# Altium schematic sheet Encoder.SchDoc
size A4; SheetNumber: 3; SheetTotal: 4
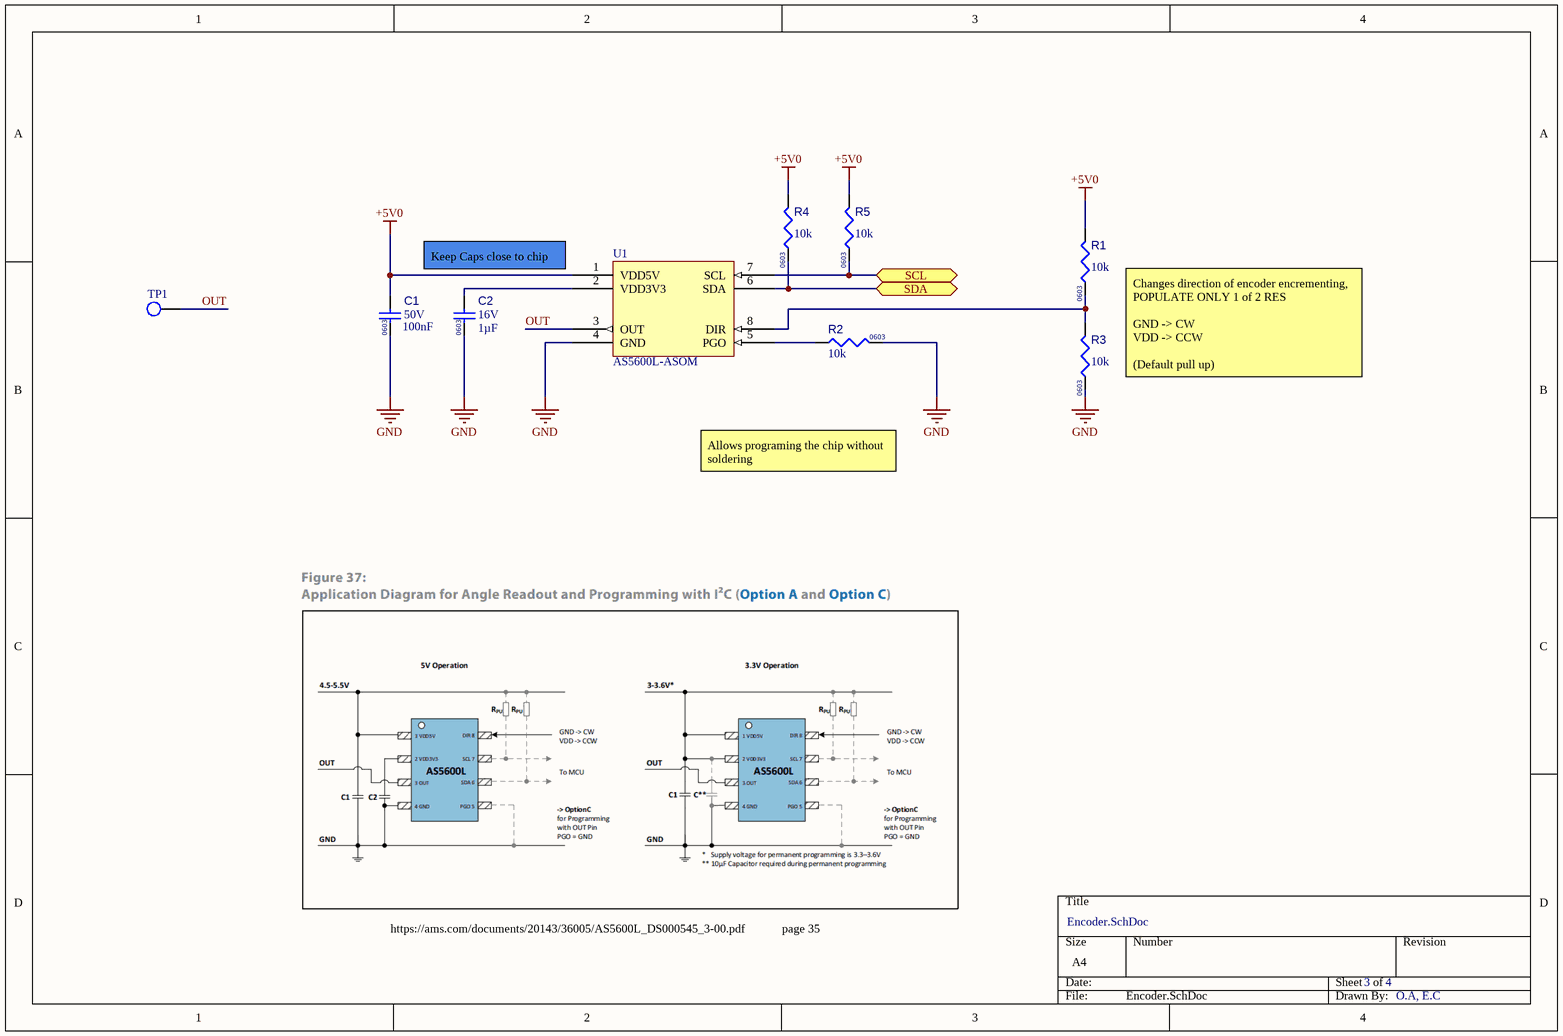
[diagram p0: Encoder.SchDoc]

## Parts
C1  value 100nF  Voltage Rating: 50V  Case/Package: 0603  [CAPC1608X90X40NL10T20]  (hidden comment: Capacitor 100 nF +/-10% 50 V 0603)
C2  value 1µF  Case/Package: 0603  Voltage Rating: 16V  [CAPC1608X90X35NL15T15]  (hidden comment: Capacitor 1uF +/- 10% 16V 0603)
R1  value 10k  Case/Package: 0603  [RESC1608X55X25NL10T15]  (hidden comment: Resistor 10k +/-1% 0603 100 mW)
R2  value 10k  Case/Package: 0603  [RESC1608X55X25NL10T15]  (hidden comment: Resistor 10k +/-1% 0603 100 mW)
R3  value 10k  Case/Package: 0603  [RESC1608X55X25NL10T15]  (hidden comment: Resistor 10k +/-1% 0603 100 mW)
R4  value 10k  Case/Package: 0603  [RESC1608X55X25NL10T15]  (hidden comment: Resistor 10k +/-1% 0603 100 mW)
R5  value 10k  Case/Package: 0603  [RESC1608X55X25NL10T15]  (hidden comment: Resistor 10k +/-1% 0603 100 mW)
TP1  RCUCTE  [FP-S2761-46R-MFG]  (value not drawn)
U1  AS5600L-ASOM  [AS5600L-ASOM-Footprint-1]

## Ports
SCL (bidir), SDA (bidir)

## Nets
+5V0: C1.2 R1.2 R4.2 R5.2 U1.1(VDD5V)
GND: C1.1 C2.1 R2.2 R3.1 U1.4(GND)
OUT: TP1.1 U1.3(OUT)
SCL: R5.1 U1.7(SCL) ; port SCL
SDA: R4.1 U1.6(SDA) ; port SDA
NetC2_2: C2.2 U1.2(VDD3V3)
NetR1_1: R1.1 R3.2 U1.8(DIR)
NetR2_1: R2.1 U1.5(PGO)

## Notes on the sheet
- Keep Caps close to chip
- Changes direction of encoder encrementing, POPULATE ONLY 1 of 2 RES
  GND -> CW
  VDD -> CCW
  (Default pull up)
- Allows programing the chip without soldering
- https://ams.com/documents/20143/36005/AS5600L_DS000545_3-00.pdf
- page 35
- O.A, E.C

## Library data of the parts
C1 = CMP-001-00017-8: Chip Capacitor, 100 nF, +/- 10%, 50 V, 0603 (1608 Metric); Capacitor Type: Ceramic; Tolerance: 10%; Mounting Technology: SM; Max Operating Temperature: 125°C; RoHS Compliant: True; Pins: 2; Min Operating Temperature: -55°C
C2 = CMP-001-00004-8: Chip Capacitor, 1 uF, +/- 10%, 16 V, 0603 (1608 Metric); Capacitor Type: Ceramic; Mounting Technology: SM; RoHS Compliant: True; Min Operating Temperature: -55°C; Pins: 2; Max Operating Temperature: 125°C; Tolerance: 10%
R1-R5 = CMP-009-00017-7: Chip Resistor, 10 KOhm, +/- 1%, 01 W, -55 to 155 degC, 0603 (1608 Metric); Voltage Rating: 50V; Power: 100mW; RoHS Compliant: True; Min Operating Temperature: -55°C; Pins: 2; Mounting Technology: SM; Max Operating Temperature: 155°C; Tolerance: 1%
TP1 = CMP-002-00072-5: Test point; Connector Type: Interconnection Device; Pins: 2; Max Operating Temperature: 125°C; Case/Package: 0603; Mounting Technology: Surface Mount; RoHS Compliant: Yes; Min Operating Temperature: -55°C
U1 = CMP-010-00024-5: AS5600L Series 12-Bit Programmable On-Axis Magnetic Rotary Position Sensor; Min Supply Voltage: 3.3V; Max Supply Voltage: 5V; Min Operating Temperature: -40°C; Pins: 8; Max Operating Temperature: 125°C; Case/Package: SOIC-8; Sensor Type: Magnetic Rotary Position Sensor; Mounting Technology: SMD